# EAGLE schematic 2014_A_mother (EAGLE 6.2)
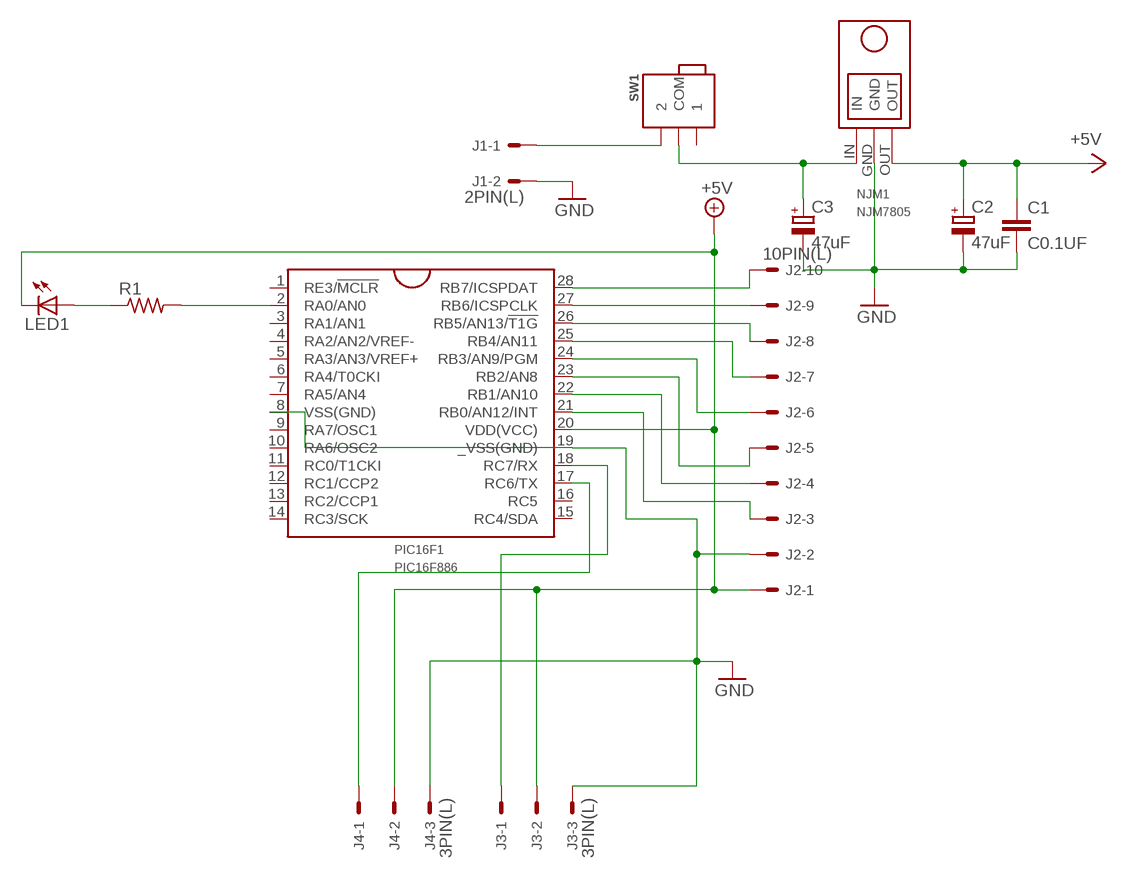
[diagram p0: schematic, sheet 1]

## Parts
C1  C0.1UF  [C0.1UF]
C2  47uF  C-ELEC  [C-6MM]
C3  47uF  C-ELEC  [C-6MM]
J1  2PIN(L)  [2PL]
J2  10PIN(L)  [10PL]
J3  3PIN(L)  [3PL]
J4  3PIN(L)  [3PL]
LED1  LED  [LED5MM]
NJM1  NJM7805  [NJM7805]
PIC16F1  PIC16F886  [DIL28-3]
R1  R-  [0207/10]
SW1  SWITCH_MINI  [SWITCH_MINI]

## Nets
+5V: C1.1 C2.+ J2.1 J3.2 J4.2 LED1.K(C) NJM1.OUT PIC16F1.20(VDD(VCC))
GND: C1.2 C2.- C3.- J1.2 J2.2 J3.3 J4.3 NJM1.GND PIC16F1.8(VSS(GND)) PIC16F1.19(_VSS(GND))
N$1: J1.1 SW1.2
N$2: C3.+ NJM1.IN SW1.COM
N$3: J2.10 PIC16F1.28(RB7/ICSPDAT)
N$4: J2.9 PIC16F1.27(RB6/ICSPCLK)
N$5: J2.8 PIC16F1.26(RB5/AN13/!T1G)
N$6: J2.7 PIC16F1.25(RB4/AN11)
N$7: J2.6 PIC16F1.24(RB3/AN9/PGM)
N$8: J2.5 PIC16F1.23(RB2/AN8)
N$9: J2.4 PIC16F1.22(RB1/AN10)
N$10: J2.3 PIC16F1.21(RB0/AN12/INT)
N$11: J3.1 PIC16F1.18(RC7/RX)
N$12: J4.1 PIC16F1.17(RC6/TX)
N$13: PIC16F1.2(RA0/AN0) R1.2
N$14: LED1.A R1.1
Unconnected: PIC16F1.1(RE3/!MCLR) PIC16F1.3(RA1/AN1) PIC16F1.4(RA2/AN2/VREF-) PIC16F1.5(RA3/AN3/VREF+) PIC16F1.6(RA4/T0CKI) PIC16F1.7(RA5/AN4) PIC16F1.9(RA7/OSC1) PIC16F1.10(RA6/OSC2) PIC16F1.11(RC0/T1CKI) PIC16F1.12(RC1/CCP2) PIC16F1.13(RC2/CCP1) PIC16F1.14(RC3/SCK) PIC16F1.15(RC4/SDA) PIC16F1.16(RC5) SW1.1

## Library data of the parts
C1 = FP-21T for MITS:C0.1UF
C2 C3 = My_rcl:C-ELEC
J1 = my_connector:2PIN(L)
J2 = my_connector:10PIN(L)
J3 J4 = my_connector:3PIN(L)
LED1 = my_led:LED: LED
NJM1 = My_NJM7805:NJM7805
PIC16F1 = FixLib:PIC16F886
R1 = My_rcl:R-: Resistor
SW1 = FP-21T for MITS:SWITCH_MINI: Switch 5.08mm